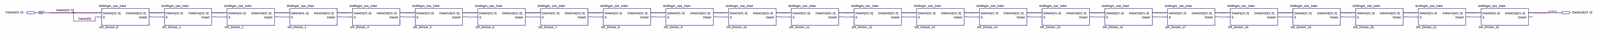
[diagram p0: schematic sheet, whole]
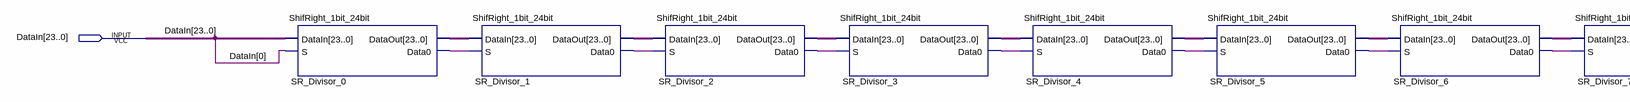
[diagram p1: schematic sheet, left part]
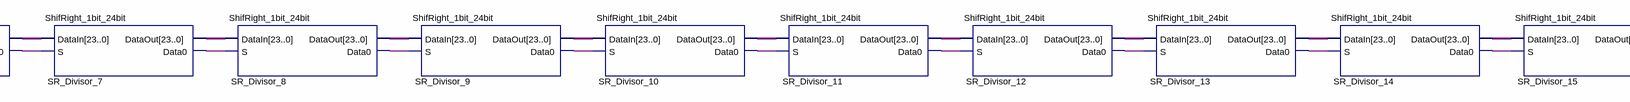
[diagram p2: schematic sheet, centre part]
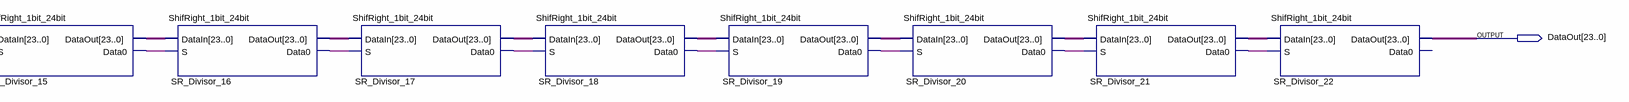
[diagram p3: schematic sheet, right part]
// Quartus schematic ShiftRight_Divisor.bdf as structural Verilog: 23 symbols, 2 pins
module ShiftRight_Divisor (
  input  [23:0] DataIn,
  output [23:0] DataOut
);

  wire SR_Divisor_0_data0, SR_Divisor_1_data0, SR_Divisor_2_data0, SR_Divisor_3_data0, SR_Divisor_4_data0,
       SR_Divisor_5_data0, SR_Divisor_6_data0, SR_Divisor_7_data0, SR_Divisor_8_data0, SR_Divisor_9_data0,
       SR_Divisor_10_data0, SR_Divisor_11_data0, SR_Divisor_12_data0, SR_Divisor_13_data0,
       SR_Divisor_14_data0, SR_Divisor_15_data0, SR_Divisor_16_data0, SR_Divisor_17_data0,
       SR_Divisor_18_data0, SR_Divisor_19_data0, SR_Divisor_20_data0, SR_Divisor_21_data0;
  wire [23:0] SR_Divisor_0_dataout, SR_Divisor_1_dataout, SR_Divisor_2_dataout, SR_Divisor_3_dataout,
       SR_Divisor_4_dataout, SR_Divisor_5_dataout, SR_Divisor_6_dataout, SR_Divisor_7_dataout,
       SR_Divisor_8_dataout, SR_Divisor_9_dataout, SR_Divisor_10_dataout, SR_Divisor_11_dataout,
       SR_Divisor_12_dataout, SR_Divisor_13_dataout, SR_Divisor_14_dataout, SR_Divisor_15_dataout,
       SR_Divisor_16_dataout, SR_Divisor_17_dataout, SR_Divisor_18_dataout, SR_Divisor_19_dataout,
       SR_Divisor_20_dataout, SR_Divisor_21_dataout;

  ShifRight_1bit_24bit SR_Divisor_0 (
    .DataIn(DataIn), .S(DataIn[0]), .DataOut(SR_Divisor_0_dataout), .Data0(SR_Divisor_0_data0));
  ShifRight_1bit_24bit SR_Divisor_1 (
    .DataIn(SR_Divisor_0_dataout), .S(SR_Divisor_0_data0), .DataOut(SR_Divisor_1_dataout),
    .Data0(SR_Divisor_1_data0));
  ShifRight_1bit_24bit SR_Divisor_2 (
    .DataIn(SR_Divisor_1_dataout), .S(SR_Divisor_1_data0), .DataOut(SR_Divisor_2_dataout),
    .Data0(SR_Divisor_2_data0));
  ShifRight_1bit_24bit SR_Divisor_3 (
    .DataIn(SR_Divisor_2_dataout), .S(SR_Divisor_2_data0), .DataOut(SR_Divisor_3_dataout),
    .Data0(SR_Divisor_3_data0));
  ShifRight_1bit_24bit SR_Divisor_4 (
    .DataIn(SR_Divisor_3_dataout), .S(SR_Divisor_3_data0), .DataOut(SR_Divisor_4_dataout),
    .Data0(SR_Divisor_4_data0));
  ShifRight_1bit_24bit SR_Divisor_5 (
    .DataIn(SR_Divisor_4_dataout), .S(SR_Divisor_4_data0), .DataOut(SR_Divisor_5_dataout),
    .Data0(SR_Divisor_5_data0));
  ShifRight_1bit_24bit SR_Divisor_6 (
    .DataIn(SR_Divisor_5_dataout), .S(SR_Divisor_5_data0), .DataOut(SR_Divisor_6_dataout),
    .Data0(SR_Divisor_6_data0));
  ShifRight_1bit_24bit SR_Divisor_7 (
    .DataIn(SR_Divisor_6_dataout), .S(SR_Divisor_6_data0), .DataOut(SR_Divisor_7_dataout),
    .Data0(SR_Divisor_7_data0));
  ShifRight_1bit_24bit SR_Divisor_8 (
    .DataIn(SR_Divisor_7_dataout), .S(SR_Divisor_7_data0), .DataOut(SR_Divisor_8_dataout),
    .Data0(SR_Divisor_8_data0));
  ShifRight_1bit_24bit SR_Divisor_9 (
    .DataIn(SR_Divisor_8_dataout), .S(SR_Divisor_8_data0), .DataOut(SR_Divisor_9_dataout),
    .Data0(SR_Divisor_9_data0));
  ShifRight_1bit_24bit SR_Divisor_10 (
    .DataIn(SR_Divisor_9_dataout), .S(SR_Divisor_9_data0), .DataOut(SR_Divisor_10_dataout),
    .Data0(SR_Divisor_10_data0));
  ShifRight_1bit_24bit SR_Divisor_11 (
    .DataIn(SR_Divisor_10_dataout), .S(SR_Divisor_10_data0), .DataOut(SR_Divisor_11_dataout),
    .Data0(SR_Divisor_11_data0));
  ShifRight_1bit_24bit SR_Divisor_12 (
    .DataIn(SR_Divisor_11_dataout), .S(SR_Divisor_11_data0), .DataOut(SR_Divisor_12_dataout),
    .Data0(SR_Divisor_12_data0));
  ShifRight_1bit_24bit SR_Divisor_13 (
    .DataIn(SR_Divisor_12_dataout), .S(SR_Divisor_12_data0), .DataOut(SR_Divisor_13_dataout),
    .Data0(SR_Divisor_13_data0));
  ShifRight_1bit_24bit SR_Divisor_14 (
    .DataIn(SR_Divisor_13_dataout), .S(SR_Divisor_13_data0), .DataOut(SR_Divisor_14_dataout),
    .Data0(SR_Divisor_14_data0));
  ShifRight_1bit_24bit SR_Divisor_15 (
    .DataIn(SR_Divisor_14_dataout), .S(SR_Divisor_14_data0), .DataOut(SR_Divisor_15_dataout),
    .Data0(SR_Divisor_15_data0));
  ShifRight_1bit_24bit SR_Divisor_16 (
    .DataIn(SR_Divisor_15_dataout), .S(SR_Divisor_15_data0), .DataOut(SR_Divisor_16_dataout),
    .Data0(SR_Divisor_16_data0));
  ShifRight_1bit_24bit SR_Divisor_17 (
    .DataIn(SR_Divisor_16_dataout), .S(SR_Divisor_16_data0), .DataOut(SR_Divisor_17_dataout),
    .Data0(SR_Divisor_17_data0));
  ShifRight_1bit_24bit SR_Divisor_18 (
    .DataIn(SR_Divisor_17_dataout), .S(SR_Divisor_17_data0), .DataOut(SR_Divisor_18_dataout),
    .Data0(SR_Divisor_18_data0));
  ShifRight_1bit_24bit SR_Divisor_19 (
    .DataIn(SR_Divisor_18_dataout), .S(SR_Divisor_18_data0), .DataOut(SR_Divisor_19_dataout),
    .Data0(SR_Divisor_19_data0));
  ShifRight_1bit_24bit SR_Divisor_20 (
    .DataIn(SR_Divisor_19_dataout), .S(SR_Divisor_19_data0), .DataOut(SR_Divisor_20_dataout),
    .Data0(SR_Divisor_20_data0));
  ShifRight_1bit_24bit SR_Divisor_21 (
    .DataIn(SR_Divisor_20_dataout), .S(SR_Divisor_20_data0), .DataOut(SR_Divisor_21_dataout),
    .Data0(SR_Divisor_21_data0));
  ShifRight_1bit_24bit SR_Divisor_22 (
    .DataIn(SR_Divisor_21_dataout), .S(SR_Divisor_21_data0), .DataOut(DataOut));  // open: Data0
endmodule
